# Altium project Top board.PrjPCB
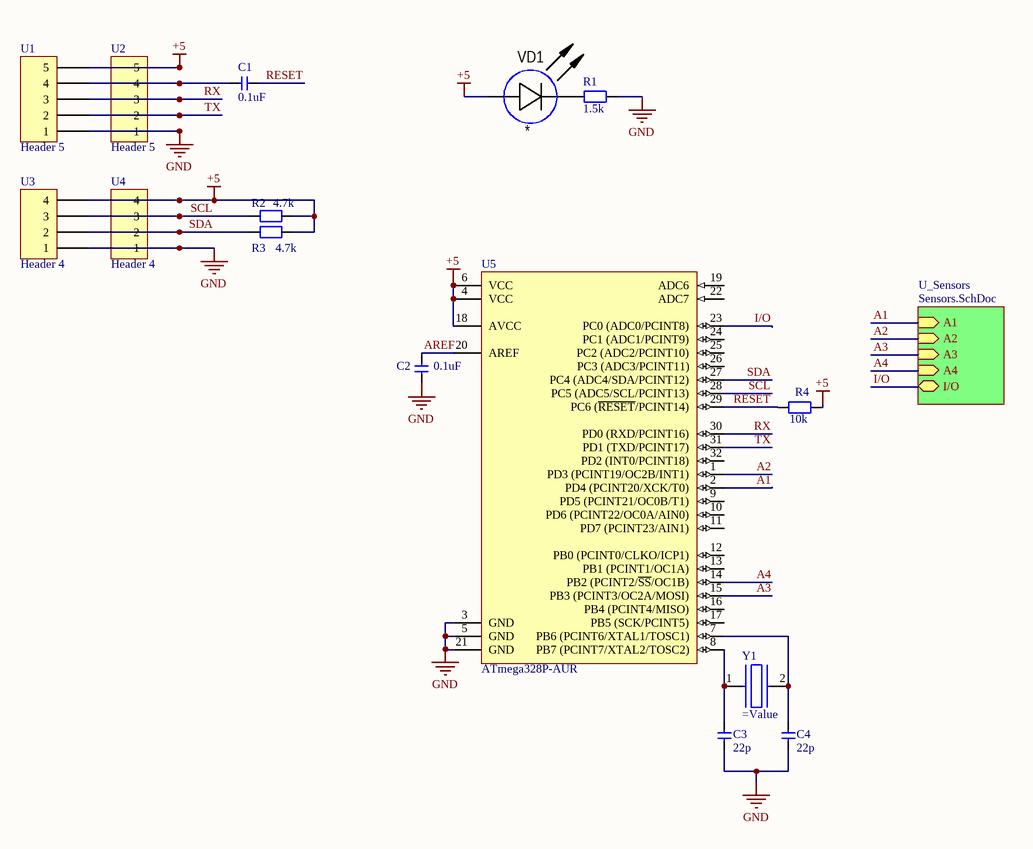
[diagram p0: MK.SchDoc]
2 sheets, 64 parts. Net scope: hierarchical (ports join the sheet entries above them; power ports are global).
Board file: top board.PcbDoc
Sheets:
  MK.SchDoc
    U_Sensors = Sensors.SchDoc

## Sheet MK.SchDoc
size A4

### Parts
C1  0.1uF  [cap0603]
C2  0.1uF  [cap0603]
C3  22p  [cap0603]
C4  22p  [cap0603]
R1  1.5k  [res0603]
R2  4.7k  [res0603]
R3  4.7k  [res0603]
R4  10k  [res0603]
U1  Header 5  [5x2.54]
U2  Header 5  [5x1.27]
U3  Header 4  [CON: PLS-4]
U4  Header 4  [4x1.25]
U5  ATmega328P-AUR  [32A_N]
VD1  *  [CH0603LB]
Y1  (no value)  [QSMD3.2x2.5_A]

### Sub-sheets
U_Sensors = Sensors.SchDoc: A1 (in), A2 (in), A3 (in), A4 (in), I/O (bidir)

### Nets
+5: R2.2 R3.2 R4.2 U1.5 U2.5 U3.4 U4.4 U5.4(VCC) U5.6(VCC) U5.18(AVCC) VD1.1(A)
GND: C2.1 C3.2 C4.2 R1.2 U1.1 U2.1 U3.1 U4.1 U5.3(GND) U5.5(GND) U5.21(GND)
A1: U5.2(PD4_(PCINT20/XCK/T0)) ; sheet U_Sensors/A1
A2: U5.1(PD3_(PCINT19/OC2B/INT1)) ; sheet U_Sensors/A2
A3: U5.15(PB3_(PCINT3/OC2A/MOSI)) ; sheet U_Sensors/A3
A4: U5.14(PB2_(PCINT2/~{SS}/OC1B)) ; sheet U_Sensors/A4
AREF: C2.2 U5.20(AREF)
I/O: U5.23(PC0_(ADC0/PCINT8)) ; sheet U_Sensors/I/O
RESET: C1.2 R4.1 U5.29(PC6_(~{RESET}/PCINT14))
RX: U1.3 U2.3 U5.30(PD0_(RXD/PCINT16))
SCL: R2.1 U3.3 U4.3 U5.28(PC5_(ADC5/SCL/PCINT13))
SDA: R3.1 U3.2 U4.2 U5.27(PC4_(ADC4/SDA/PCINT12))
TX: U1.2 U2.2 U5.31(PD1_(TXD/PCINT17))
NetC1_1: C1.1 U1.4 U2.4
NetC3_1: C3.1 U5.8(PB7_(PCINT7/XTAL2/TOSC2)) Y1.1
NetC4_1: C4.1 U5.7(PB6_(PCINT6/XTAL1/TOSC1)) Y1.2
NetR1_1: R1.1 VD1.2(C)

Not connected (* = marked no-connect by the designer): U5 9(PD5_(PCINT21/OC0B/T1)) 10(PD6_(PCINT22/OC0A/AIN0)) 11(PD7_(PCINT23/AIN1)) 12(PB0_(PCINT0/CLKO/ICP1)) 13(PB1_(PCINT1/OC1A)) 16(PB4_(PCINT4/MISO)) 17(PB5_(SCK/PCINT5)) 19(ADC6) 22(ADC7) 24(PC1_(ADC1/PCINT9)) 25(PC2_(ADC2/PCINT10)) 26(PC3_(ADC3/PCINT11)) 32(PD2_(INT0/PCINT18))

### Library data of the parts
C1-C4 = Cap SMD
R1-R4 = Resistor SMD
U5 = ATmega328P-AUR: 8-bit AVR Microcontroller, 32KB Flash, 1KB EEPROM, 2KB SRAM, 32-pin TQFP, Industrial Grade (-40°C to 85°C); Published: 1-Apr-2010; DatasheetVersion: revA, Jan-2010; PackageVersion: revB, Oct-2001; PackageReference: 32A; Publisher: Altium Limited; PackageDescription: 32-Lead, 7x7x1.0 mm Body, 0.8mm Lead Pitch, Thin Profile Plastic Quad Flat Package (TQFP); Supplier 1: Digi-Key; Supplier Part Number 1: ATMEGA328P-AUR-ND; Supplier 2: Mouser; Supplier Part Number 2: 556-ATMEGA328P-AUR; Code_JEDEC: MS-026-ABA; ComponentLink1Description: Manufacturer Link; ComponentLink1URL: http://www.atmel.com/products/avr/default.asp?; ComponentLink2Description: ATmega48A/48PA/88A/88PA/168A/168PA/328/328P Datasheet; ComponentLink2URL: http://www.atmel.com/dyn/resources/prod_documents/8271.pdf; ComponentLink3Description: ATmega48A/48PA/88A/88PA/168A/168PA/328/328P Summary; ComponentLink3URL: http://www.atmel.com/dyn/resources/prod_documents/8271S.pdf; ComponentLink4Description: Atmel.com Home; ComponentLink4URL: http://www.atmel.com
VD1 = LED: Manufacturer: *; Model: *; HelpURL: *; ComponentKind: *; Value: *
Y1 = Quartz

## Sheet Sensors.SchDoc
size A4
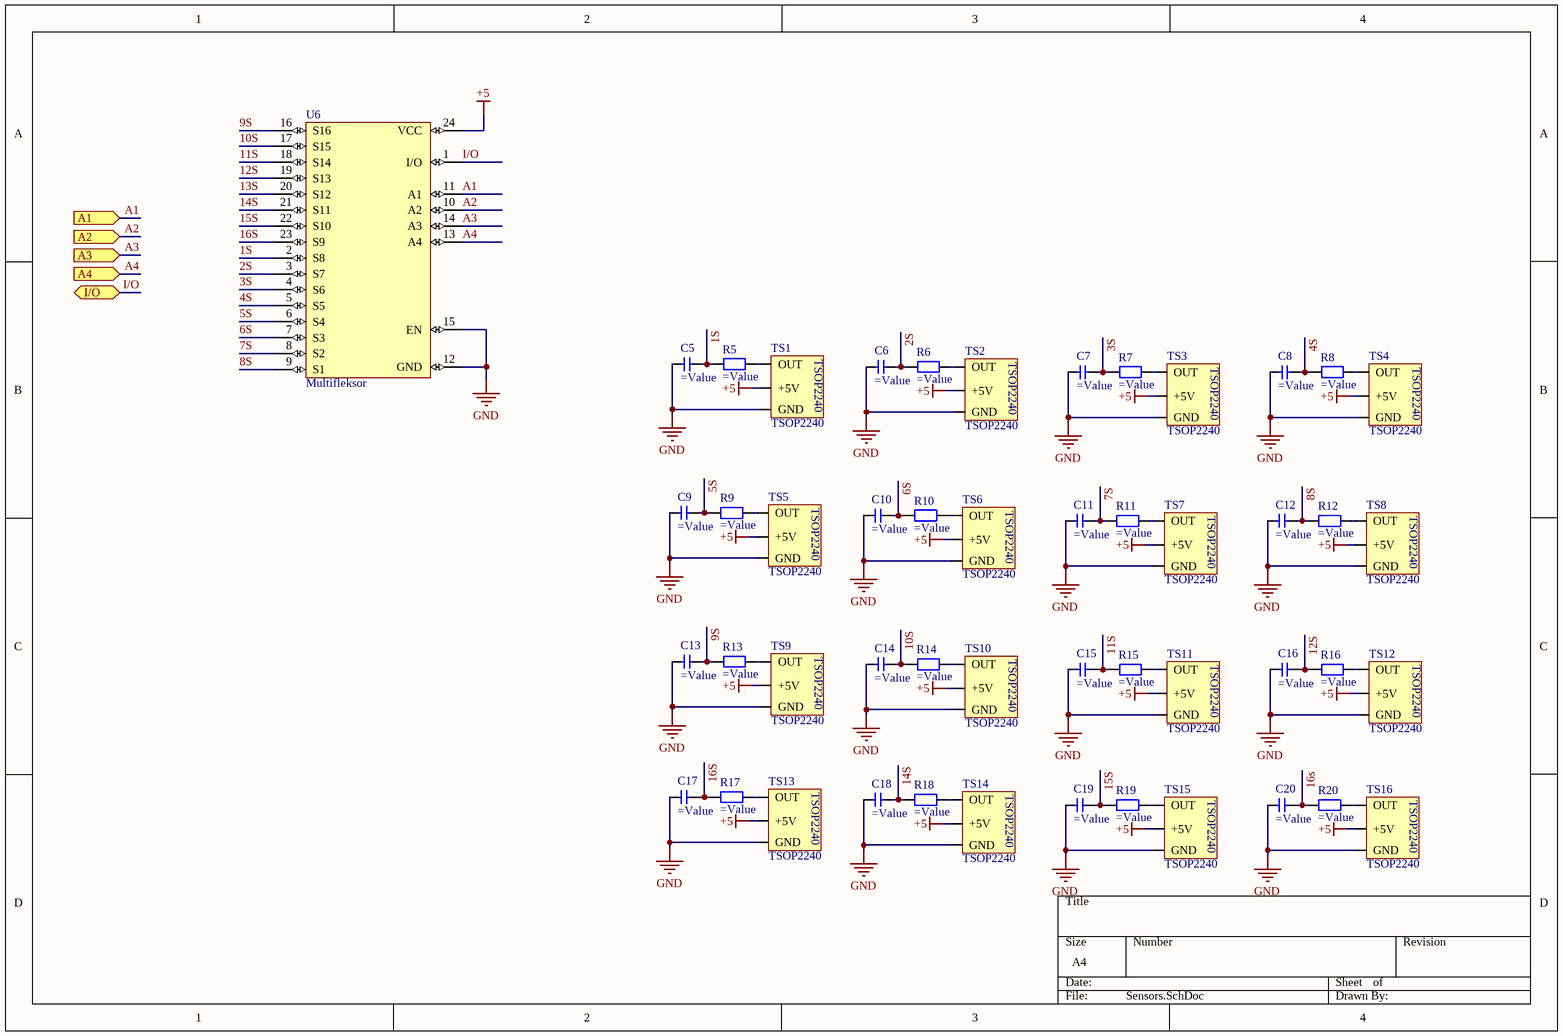
[diagram p1: Sensors.SchDoc]

### Parts
C5  (no value)  [cap0805]
C6  (no value)  [cap0805]
C7  (no value)  [cap0805]
C8  (no value)  [cap0805]
C9  (no value)  [cap0805]
C10  (no value)  [cap0805]
C11  (no value)  [cap0805]
C12  (no value)  [cap0805]
C13  (no value)  [cap0805]
C14  (no value)  [cap0805]
C15  (no value)  [cap0805]
C16  (no value)  [cap0805]
C17  (no value)  [cap0805]
C18  (no value)  [cap0805]
C19  (no value)  [cap0805]
C20  (no value)  [cap0805]
R5  (no value)  [res0805]
R6  (no value)  [res0603]
R7  (no value)  [res0805]
R8  (no value)  [res0805]
R9  (no value)  [res0805]
R10  (no value)  [res0805]
R11  (no value)  [res0805]
R12  (no value)  [res0805]
R13  (no value)  [res0805]
R14  (no value)  [res0805]
R15  (no value)  [res0805]
R16  (no value)  [res0805]
R17  (no value)  [res0805]
R18  (no value)  [res0805]
R19  (no value)  [res0805]
R20  (no value)  [res0805]
TS1  TSOP2240  [TSOP2240]
TS2  TSOP2240  [TSOP2240]
TS3  TSOP2240  [TSOP2240]
TS4  TSOP2240  [TSOP2240]
TS5  TSOP2240  [TSOP2240]
TS6  TSOP2240  [TSOP2240]
TS7  TSOP2240  [TSOP2240]
TS8  TSOP2240  [TSOP2240]
TS9  TSOP2240  [TSOP2240]
TS10  TSOP2240  [TSOP2240]
TS11  TSOP2240  [TSOP2240]
TS12  TSOP2240  [TSOP2240]
TS13  TSOP2240  [TSOP2240]
TS14  TSOP2240  [TSOP2240]
TS15  TSOP2240  [TSOP2240]
TS16  TSOP2240  [TSOP2240]
U6  Multifleksor  [SSOP-24]

### Ports
A1 (in), A2 (in), A3 (in), A4 (in), I/O (bidir)

### Nets
+5: TS1.2(+5V) TS2.2(+5V) TS3.2(+5V) TS4.2(+5V) TS5.2(+5V) TS6.2(+5V) TS7.2(+5V) TS8.2(+5V) TS9.2(+5V) TS10.2(+5V) TS11.2(+5V) TS12.2(+5V) TS13.2(+5V) TS14.2(+5V) TS15.2(+5V) TS16.2(+5V) U6.24(VCC)
GND: C5.1 C6.1 C7.1 C8.1 C9.1 C10.1 C11.1 C12.1 C13.1 C14.1 C15.1 C16.1 C17.1 C18.1 C19.1 C20.1 TS1.3(GND) TS2.3(GND) TS3.3(GND) TS4.3(GND) TS5.3(GND) TS6.3(GND) TS7.3(GND) TS8.3(GND) TS9.3(GND) TS10.3(GND) TS11.3(GND) TS12.3(GND) TS13.3(GND) TS14.3(GND) TS15.3(GND) TS16.3(GND) U6.12(GND) U6.15(EN)
1S: C5.2 R5.1 U6.2(S8)
2S: C6.2 R6.1 U6.3(S7)
3S: C7.2 R7.1 U6.4(S6)
4S: C8.2 R8.1 U6.5(S5)
5S: C9.2 R9.1 U6.6(S4)
6S: C10.2 R10.1 U6.7(S3)
7S: C11.2 R11.1 U6.8(S2)
8S: C12.2 R12.1 U6.9(S1)
9S: C13.2 R13.1 U6.16(S16)
10S: C14.2 R14.1 U6.17(S15)
11S: C15.2 R15.1 U6.18(S14)
12S: C16.2 R16.1 U6.19(S13)
13S: U6.20(S12)
14S: C18.2 R18.1 U6.21(S11)
15S: C19.2 R19.1 U6.22(S10)
16S: C17.2 C20.2 R17.1 R20.1 U6.23(S9)
A1: U6.11(A1) ; port A1
A2: U6.10(A2) ; port A2
A3: U6.14(A3) ; port A3
A4: U6.13(A4) ; port A4
I/O: U6.1(I/O) ; port I/O
NetR5_2: R5.2 TS1.1(OUT)
NetR6_2: R6.2 TS2.1(OUT)
NetR7_2: R7.2 TS3.1(OUT)
NetR8_2: R8.2 TS4.1(OUT)
NetR9_2: R9.2 TS5.1(OUT)
NetR10_2: R10.2 TS6.1(OUT)
NetR11_2: R11.2 TS7.1(OUT)
NetR12_2: R12.2 TS8.1(OUT)
NetR13_2: R13.2 TS9.1(OUT)
NetR14_2: R14.2 TS10.1(OUT)
NetR15_2: R15.2 TS11.1(OUT)
NetR16_2: R16.2 TS12.1(OUT)
NetR17_2: R17.2 TS13.1(OUT)
NetR18_2: R18.2 TS14.1(OUT)
NetR19_2: R19.2 TS15.1(OUT)
NetR20_2: R20.2 TS16.1(OUT)

### Library data of the parts
C5-C20 = Cap SMD
R5-R20 = Resistor SMD

## Nets that join several sheets
+5: MK (11 pins), Sensors (17 pins)
GND: MK (11 pins), Sensors (34 pins)
A1: MK (U5.2), Sensors (U6.11)
A2: MK (U5.1), Sensors (U6.10)
A3: MK (U5.15), Sensors (U6.14)
A4: MK (U5.14), Sensors (U6.13)
I/O: MK (U5.23), Sensors (U6.1)